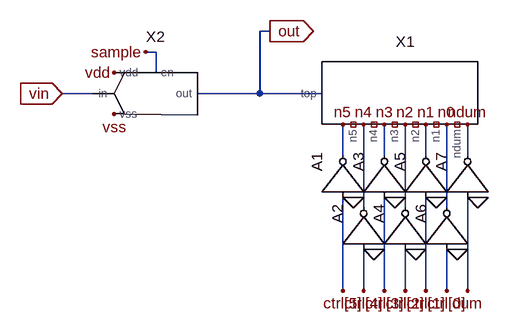
[diagram p0: schematic Draft11.asc]
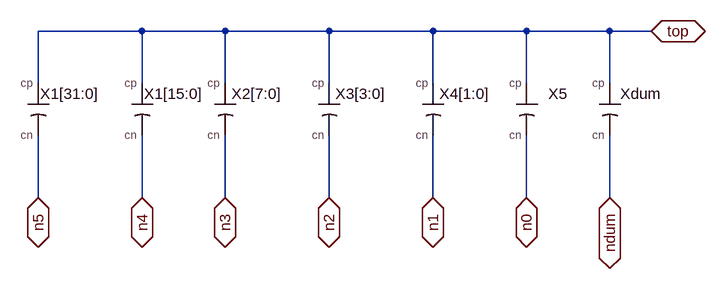
[diagram p1: sub-circuit carray.asc]
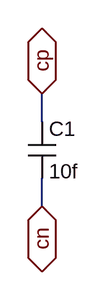
[diagram p2: sub-circuit unit_cap.asc]
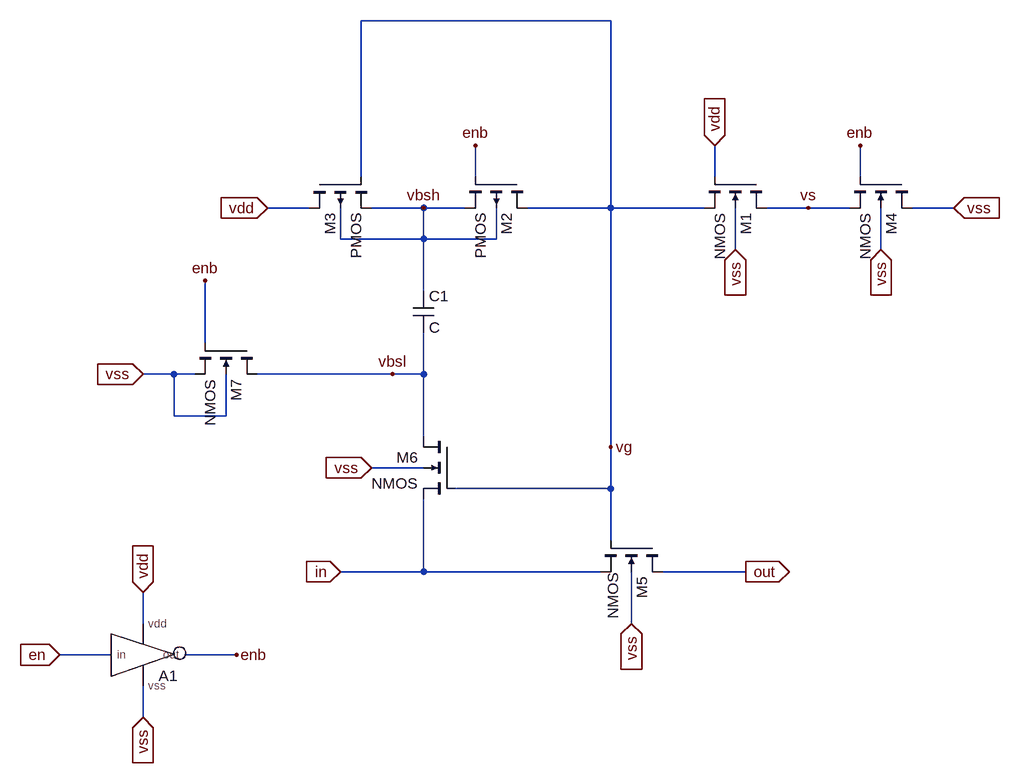
[diagram p3: sub-circuit bootstrapped_sw.asc]
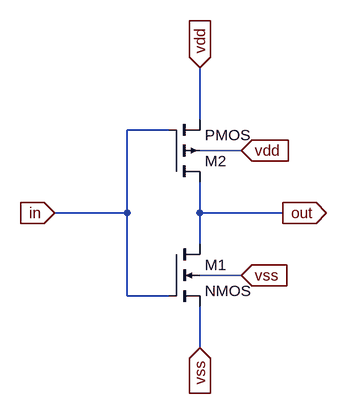
[diagram p4: sub-circuit inv_lvt.asc]
Draft11.asc, the LTspice schematic file:
Version 4
SHEET 1 880 680
WIRE 96 64 80 64
WIRE -80 96 -96 96
WIRE -80 128 -80 96
WIRE -176 160 -224 160
WIRE 80 160 80 64
WIRE 80 160 -16 160
WIRE 176 160 80 160
WIRE 208 256 208 208
WIRE 272 256 272 208
WIRE 336 256 336 208
WIRE 400 256 400 208
WIRE 240 336 240 208
WIRE 304 336 304 208
WIRE 368 336 368 208
WIRE 208 464 208 320
WIRE 240 464 240 400
WIRE 272 464 272 320
WIRE 304 464 304 400
WIRE 336 464 336 320
WIRE 368 464 368 400
WIRE 400 464 400 320
FLAG 96 64 out
IOPIN 96 64 Out
FLAG -224 160 vin
IOPIN -224 160 In
FLAG -144 128 vdd
FLAG -144 192 vss
FLAG -96 96 sample
FLAG 208 208 n5
FLAG 240 208 n4
FLAG 272 208 n3
FLAG 304 208 n2
FLAG 336 208 n1
FLAG 368 208 n0
FLAG 224 320 0
FLAG 288 320 0
FLAG 352 320 0
FLAG 384 400 0
FLAG 320 400 0
FLAG 256 400 0
FLAG 208 464 ctrl[5]
FLAG 240 464 ctrl[4]
FLAG 272 464 ctrl[3]
FLAG 304 464 ctrl[2]
FLAG 336 464 ctrl[1]
FLAG 368 464 ctrl[0]
FLAG 400 208 ndum
FLAG 416 320 0
FLAG 400 464 dum
SYMBOL carray 112 160 R0
SYMATTR InstName X1
SYMBOL bootstrapped_sw -80 160 R0
SYMATTR InstName X2
SYMBOL Digital\\inv 144 320 R270
SYMATTR InstName A1
SYMATTR SpiceLine Vhigh={Vhigh} Vlow={Vlow} Td={Td} Trise={Trise}
SYMBOL Digital\\inv 176 400 R270
SYMATTR InstName A2
SYMATTR SpiceLine Vhigh={Vhigh} Vlow={Vlow} Td={Td} Trise={Trise}
SYMBOL Digital\\inv 208 320 R270
SYMATTR InstName A3
SYMATTR SpiceLine Vhigh={Vhigh} Vlow={Vlow} Td={Td} Trise={Trise}
SYMBOL Digital\\inv 240 400 R270
SYMATTR InstName A4
SYMATTR SpiceLine Vhigh={Vhigh} Vlow={Vlow} Td={Td} Trise={Trise}
SYMBOL Digital\\inv 272 320 R270
SYMATTR InstName A5
SYMATTR SpiceLine Vhigh={Vhigh} Vlow={Vlow} Td={Td} Trise={Trise}
SYMBOL Digital\\inv 304 400 R270
SYMATTR InstName A6
SYMATTR SpiceLine Vhigh={Vhigh} Vlow={Vlow} Td={Td} Trise={Trise}
SYMBOL Digital\\inv 336 320 R270
SYMATTR InstName A7
SYMATTR SpiceLine Vhigh={Vhigh} Vlow={Vlow} Td={Td} Trise={Trise}

carray.asc, the sub-circuit schematic file:
Version 4
SHEET 1 1312 680
WIRE 416 112 256 112
WIRE 544 112 416 112
WIRE 704 112 544 112
WIRE 864 112 704 112
WIRE 1008 112 864 112
WIRE 1136 112 1008 112
WIRE 1200 112 1136 112
WIRE 256 192 256 112
WIRE 416 192 416 112
WIRE 544 192 544 112
WIRE 704 192 704 112
WIRE 864 192 864 112
WIRE 1008 192 1008 112
WIRE 1136 192 1136 112
WIRE 256 368 256 272
WIRE 416 368 416 272
WIRE 544 368 544 272
WIRE 704 368 704 272
WIRE 864 368 864 272
WIRE 1008 368 1008 272
WIRE 1136 368 1136 272
FLAG 256 368 n5
IOPIN 256 368 BiDir
FLAG 416 368 n4
IOPIN 416 368 BiDir
FLAG 544 368 n3
IOPIN 544 368 BiDir
FLAG 704 368 n2
IOPIN 704 368 BiDir
FLAG 864 368 n1
IOPIN 864 368 BiDir
FLAG 1136 368 ndum
IOPIN 1136 368 BiDir
FLAG 1200 112 top
IOPIN 1200 112 BiDir
FLAG 1008 368 n0
IOPIN 1008 368 BiDir
SYMBOL unit_cap 352 240 R0
SYMATTR InstName X1[31:0]
SYMBOL unit_cap 512 240 R0
SYMATTR InstName X1[15:0]
SYMBOL unit_cap 640 240 R0
SYMATTR InstName X2[7:0]
SYMBOL unit_cap 800 240 R0
SYMATTR InstName X3[3:0]
SYMBOL unit_cap 960 240 R0
SYMATTR InstName X4[1:0]
SYMBOL unit_cap 1232 240 R0
SYMATTR InstName Xdum
SYMBOL unit_cap 1104 240 R0
SYMATTR InstName X5

unit_cap.asc, the sub-circuit schematic file:
Version 4
SHEET 1 880 680
WIRE 240 160 240 128
WIRE 240 256 240 224
FLAG 240 256 cn
IOPIN 240 256 BiDir
FLAG 240 128 cp
IOPIN 240 128 BiDir
SYMBOL cap 224 160 R0
SYMATTR InstName C1
SYMATTR Value 10f

bootstrapped_sw.asc, the sub-circuit schematic file:
Version 4
SHEET 1 880 900
WIRE 48 -256 -336 -256
WIRE -336 -16 -336 -256
WIRE -160 -16 -160 -64
WIRE 208 -16 208 -64
WIRE 432 -16 432 -64
WIRE -416 32 -480 32
WIRE -240 32 -320 32
WIRE -176 32 -240 32
WIRE 48 32 48 -256
WIRE 48 32 -80 32
WIRE 192 32 48 32
WIRE 352 32 288 32
WIRE 416 32 352 32
WIRE 576 32 512 32
WIRE -368 80 -368 32
WIRE -240 80 -240 32
WIRE -240 80 -368 80
WIRE -128 80 -128 32
WIRE -128 80 -240 80
WIRE 240 96 240 32
WIRE 464 96 464 32
WIRE -240 160 -240 80
WIRE -576 240 -576 144
WIRE -624 288 -672 288
WIRE -592 288 -624 288
WIRE -288 288 -496 288
WIRE -240 288 -240 224
WIRE -240 288 -288 288
WIRE -624 352 -624 288
WIRE -544 352 -544 288
WIRE -544 352 -624 352
WIRE -240 384 -240 288
WIRE 48 400 48 32
WIRE -240 432 -320 432
WIRE 48 464 48 400
WIRE 48 464 -192 464
WIRE 48 544 48 464
WIRE -240 592 -240 480
WIRE -240 592 -368 592
WIRE 32 592 -240 592
WIRE 256 592 128 592
WIRE -672 672 -672 624
WIRE 80 672 80 592
WIRE -720 720 -800 720
WIRE -528 720 -608 720
WIRE -672 816 -672 768
FLAG 432 -64 enb
FLAG -528 720 enb
FLAG -576 144 enb
FLAG -672 288 vss
IOPIN -672 288 In
FLAG -320 432 vss
IOPIN -320 432 In
FLAG 80 672 vss
IOPIN 80 672 In
FLAG 464 96 vss
IOPIN 464 96 In
FLAG 240 96 vss
IOPIN 240 96 In
FLAG 576 32 vss
IOPIN 576 32 In
FLAG -480 32 vdd
IOPIN -480 32 In
FLAG 208 -64 vdd
IOPIN 208 -64 In
FLAG -240 32 vbsh
FLAG -288 288 vbsl
FLAG 48 400 vg
FLAG 352 32 vs
FLAG 256 592 out
IOPIN 256 592 Out
FLAG -368 592 in
IOPIN -368 592 In
FLAG -800 720 en
IOPIN -800 720 In
FLAG -160 -64 enb
FLAG -672 816 vss
IOPIN -672 816 In
FLAG -672 624 vdd
IOPIN -672 624 In
SYMBOL nmos4 288 -16 R90
SYMATTR InstName M1
SYMBOL pmos4 -80 -16 R90
SYMATTR InstName M2
SYMBOL pmos4 -416 -16 M90
SYMATTR InstName M3
SYMBOL nmos4 512 -16 R90
SYMATTR InstName M4
SYMBOL nmos4 128 544 R90
WINDOW 3 49 76 Left 2
SYMATTR InstName M5
SYMBOL nmos4 -192 384 M0
SYMATTR InstName M6
SYMBOL nmos4 -496 240 R90
SYMATTR InstName M7
SYMBOL cap -256 160 R0
SYMATTR InstName C1
SYMBOL inv_lvt -656 720 R0
WINDOW 0 8 32 Left 2
WINDOW 3 8 104 Left 2
SYMATTR InstName A1
SYMATTR Prefix A
SYMATTR SpiceModel BUF
SYMATTR Description Behavioral Inverter

inv_lvt.asc, the sub-circuit schematic file:
Version 4
SHEET 1 880 680
WIRE 272 -16 272 -96
WIRE 224 0 160 0
WIRE 336 32 272 32
WIRE 160 128 160 0
WIRE 160 128 48 128
WIRE 272 128 272 80
WIRE 400 128 272 128
WIRE 272 176 272 128
WIRE 336 224 272 224
WIRE 160 256 160 128
WIRE 224 256 160 256
WIRE 272 336 272 272
FLAG 272 -96 vdd
IOPIN 272 -96 In
FLAG 272 336 vss
IOPIN 272 336 In
FLAG 336 32 vdd
IOPIN 336 32 In
FLAG 336 224 vss
IOPIN 336 224 In
FLAG 400 128 out
IOPIN 400 128 Out
FLAG 48 128 in
IOPIN 48 128 In
SYMBOL nmos4 224 176 R0
SYMATTR InstName M1
SYMBOL pmos4 224 80 M180
SYMATTR InstName M2

The netlist it stands for:
* Draft11.asc
XX1 NC_01 NC_02 NC_03 NC_04 NC_05 NC_06 out carray
XX2 sample vin vdd vss out bootstrapped_sw
A1 ctrl[5] 0 0 0 0 n5 0 0 BUF Vhigh={Vhigh} Vlow={Vlow} Td={Td} Trise={Trise}
A2 ctrl[4] 0 0 0 0 n4 0 0 BUF Vhigh={Vhigh} Vlow={Vlow} Td={Td} Trise={Trise}
A3 ctrl[3] 0 0 0 0 n3 0 0 BUF Vhigh={Vhigh} Vlow={Vlow} Td={Td} Trise={Trise}
A4 ctrl[2] 0 0 0 0 n2 0 0 BUF Vhigh={Vhigh} Vlow={Vlow} Td={Td} Trise={Trise}
A5 ctrl[1] 0 0 0 0 n1 0 0 BUF Vhigh={Vhigh} Vlow={Vlow} Td={Td} Trise={Trise}
A6 ctrl[0] 0 0 0 0 n0 0 0 BUF Vhigh={Vhigh} Vlow={Vlow} Td={Td} Trise={Trise}
A7 dum 0 0 0 0 ndum 0 0 BUF Vhigh={Vhigh} Vlow={Vlow} Td={Td} Trise={Trise}

* block symbol definitions
.subckt carray n1 n2 n3 n4 n5 ndum top
XX1[31:0] n5 top unit_cap
XX1[15:0] n4 top unit_cap
XX2[7:0] n3 top unit_cap
XX3[3:0] n2 top unit_cap
XX4[1:0] n1 top unit_cap
XXdum ndum top unit_cap
XX5 n0 top unit_cap
.ends carray

.subckt unit_cap cn cp
C1 cp cn 10f
.ends unit_cap

.subckt bootstrapped_sw en in vdd vss out
M1 vs vdd vg vss NMOS
M2 vg enb vbsh vbsh PMOS
M3 vdd vg vbsh vbsh PMOS
M4 vss enb vs vss NMOS
M5 out vg in vss NMOS
M6 vbsl vg in vss NMOS
M7 vbsl enb vss vss NMOS
C1 vbsh vbsl C
A1 en vdd vss enb 0 0 0 0 inv_lvt
.ends bootstrapped_sw

.subckt inv_lvt in vdd vss out
M1 out in vss vss NMOS
M2 out in vdd vdd PMOS
.ends inv_lvt

.model NMOS NMOS
.model PMOS PMOS
.lib standard.mos
.backanno
.end